# Altium schematic sheet 741 Operational Amplifier.schdoc: 741 Operational Amplifier Simulation
size A4; Organization: Altium Limited; Address1: L3, 12a Rodborough Rd; Address2: Frenchs Forest; Address3: NSW; Address4: Australia 2086; DocumentNumber: 1; SheetNumber: 1; SheetTotal: 1
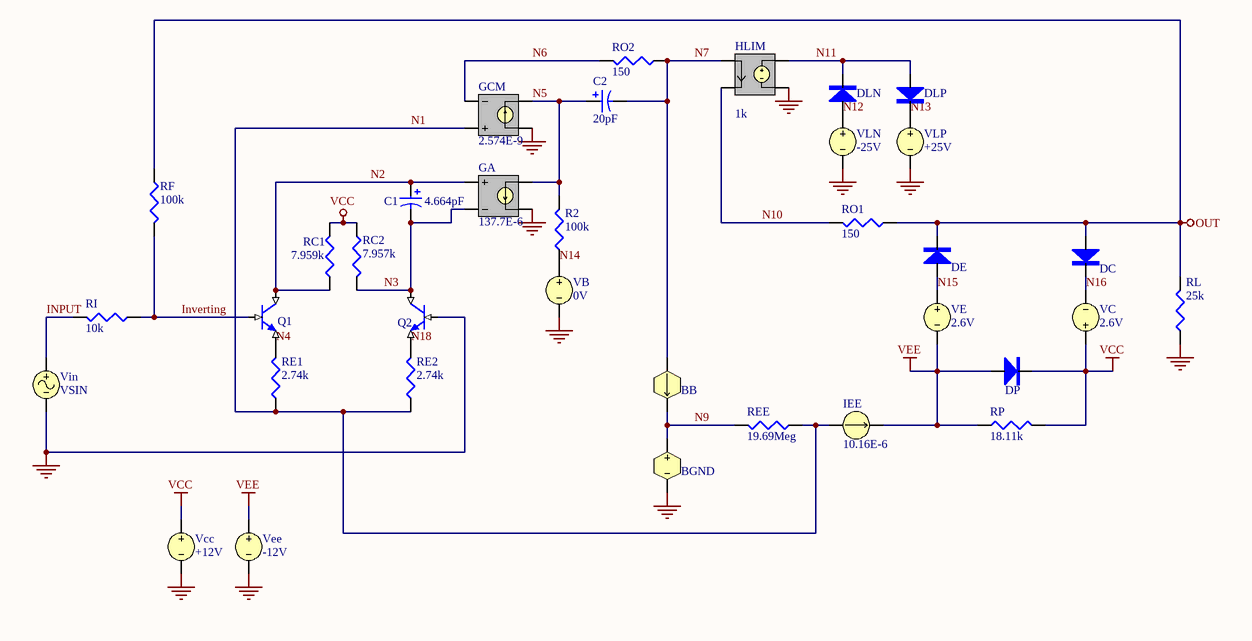
[diagram p0: 741 Operational Amplifier.schdoc]

## Parts
BB  I(VB)*10.61E6-I(VC)*10E6+I(VE)*10E6+I(VLP)*10E6-I(VLN)*10E6  (value not drawn)
BGND  V(VCC)*.5+V(VEE)*.5  (value not drawn)
C1  4.664pF
C2  20pF
DC  1N914  (value not drawn)
DE  1N914  (value not drawn)
DLN  1N914  (value not drawn)
DLP  1N914  (value not drawn)
DP  1N914  (value not drawn)
GA  137.7E-6
GCM  2.574E-9
HLIM  1k
IEE  10.16E-6
Q1  2N2222A  (value not drawn)
Q2  2N2222A  (value not drawn)
R2  100k
RC1  7.959k
RC2  7.957k
RE1  2.74k
RE2  2.74k
REE  19.69Meg
RF  100k
RI  10k
RL  25k
RO1  150
RO2  150
RP  18.11k
VB  0V
VC  2.6V
Vcc  +12V
VE  2.6V
Vee  -12V
Vin  VSIN
VLN  -25V
VLP  +25V

## Nets
GND: BGND.2 GA.4(N-) GCM.3(N+) HLIM.4(N-) Q2.2(B) RL.2(BOT) VB.2 Vcc.2 Vee.2 Vin.2 VLN.2 VLP.2
OUT: DC.1(A) DE.2(K) RF.2(BOT) RL.1(TOP) RO1.2(BOT)
VCC: DP.2(K) RC1.1(TOP) RC2.2(BOT) RP.1(TOP) VC.1 Vcc.1
VEE: DP.1(A) IEE.2 RP.2(BOT) VE.2 Vee.1
INPUT: RI.1(TOP) Vin.1
Inverting: Q1.2(B) RF.1(TOP) RI.2(BOT)
N1: GCM.1(NC+) IEE.1 RE1.2(BOT) RE2.2(BOT) REE.2(BOT)
N2: C1.1 GA.1(NC+) Q1.1(C) RC1.2(BOT)
N3: C1.2 GA.2(NC-) Q2.1(C) RC2.1(TOP)
N4: Q1.3(E) RE1.1(TOP)
N5: C2.1 GA.3(N+) GCM.4(N-) R2.1(TOP)
N6: GCM.2(NC-) RO2.1(TOP)
N7: BB.1 C2.2 HLIM.1(NC+) RO2.2(BOT)
N9: BB.2 BGND.1 REE.1(TOP)
N10: HLIM.2(NC-) RO1.1(TOP)
N11: DLN.2(K) DLP.1(A) HLIM.3(N+)
N12: DLN.1(A) VLN.1
N13: DLP.2(K) VLP.1
N14: R2.2(BOT) VB.1
N15: DE.1(A) VE.1
N16: DC.2(K) VC.2
N18: Q2.3(E) RE2.1(TOP)

## Notes on the sheet
- Title
- Size:
- Date:
- A4
- Number:
- Time:
- Revision:
- Sheet
- of
- File:

## Library data of the parts
BB = BISRC: Non-Linear Dependent Current Source
BGND = BVSRC: Non-Linear Dependent Voltage Source
C1 C2 = CAP2: Bi-Polar Capacitor
  C1: Value: 4.664pF
  C2: Value: 20pF
DC DE DLN DLP DP = 1N914: Diode
GA GCM = GSRC: Voltage Controlled Current Source
  GA: Gain: 137.7E-6
  GCM: Gain: 2.574E-9
HLIM = HSRC: Current Controlled Voltage Source; Gain: 1k
IEE = ISRC: Current Source; Value: 10.16E-6
Q1 Q2 = 2N2222A: NPN BJT
R2 RC1 RC2 RE1 RE2 REE RF RI RL RO1 RO2 RP = RES: Resistor
  R2 RF: Value: 100k
  RC1: Value: 7.959k
  RC2: Value: 7.957k
  RE1 RE2: Value: 2.74k
  REE: Value: 19.69Meg
  RI: Value: 10k
  RL: Value: 25k
  RO1 RO2: Value: 150
  RP: Value: 18.11k
VB VC Vcc VE Vee VLN VLP = VSRC: Voltage Source
  VB: Value: 0V
  VC VE: Value: 2.6V
  Vcc: Value: +12V
  Vee: Value: -12V
  VLN: Value: -25V
  VLP: Value: +25V
Vin = VSIN: Sinusoidal Voltage Source; Offset: 0; Amplitude: 1; Frequency: 10k